# Altium schematic sheet Power_Circuit.SchDoc
size 297 x 209 mm; SheetNumber: 2; SheetTotal: 6
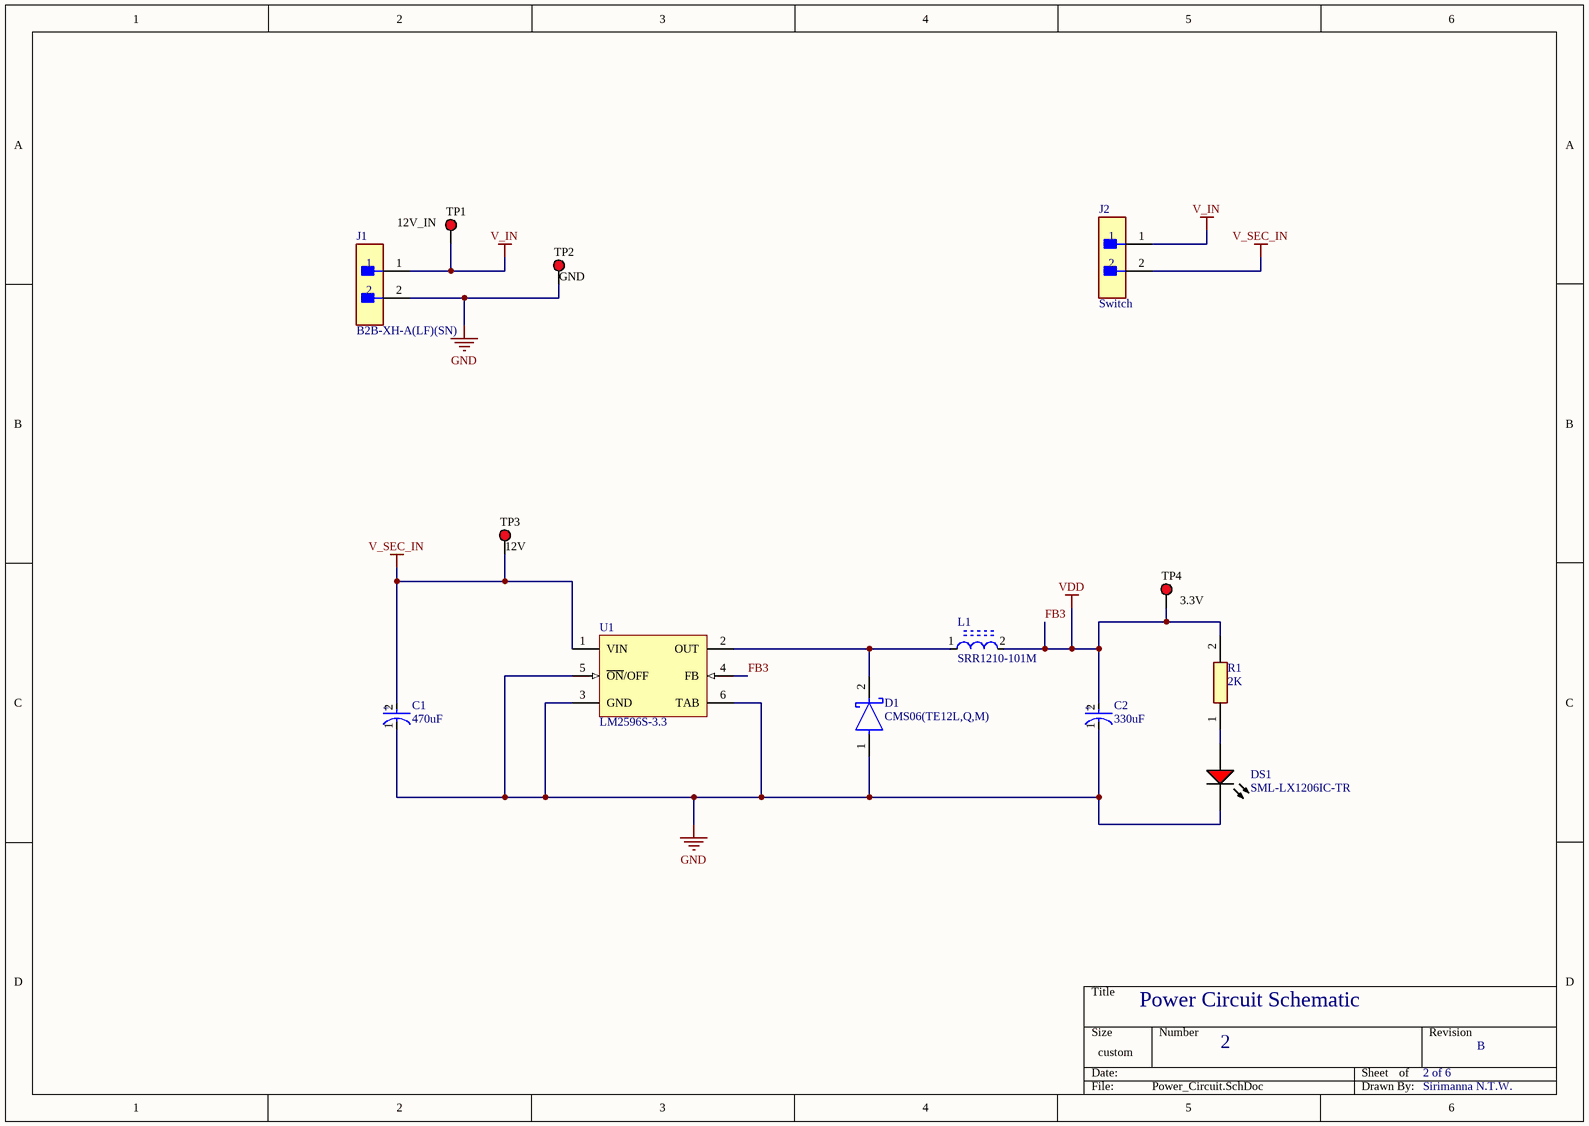
[diagram p0: Power_Circuit.SchDoc]

## Parts
C1  470uF  [FP-ZAG-MFG]
C2  330uF  [FP-FKG-MFG]
D1  CMS06(TE12L,Q,M)  [FP-M-FLAT-MFG]
DS1  SML-LX1206IC-TR  [LUMX-SML-LX1206IC_V]
J1  B2B-XH-A(LF)(SN)  [FP-B2B-XH-A_LF_SN-MFG]
J2  Switch  [FP-B2B-XH-A_LF_SN-MFG]
L1  SRR1210-101M  [FP-SRR1210-MFG]
R1  2K  [RESC3216X75N]
TP1  12V_IN  [KSTN-5010_V]
TP2  GND  [KSTN-5010_V]
TP3  12V  [KSTN-5010_V]
TP4  3.3V  [KSTN-5010_V]
U1  LM2596S-3.3  [KTT0005B_N]

## Nets
FB3: C2.2(A) L1.2 R1.2 TP4.1 U1.4(FB)  [also labelled VDD]
GND: C1.1(C) C2.1(C) D1.1(A) DS1.2(K) J1.2 TP2.1 U1.3(GND) U1.5(~{ON}/OFF) U1.6(TAB)
V_IN: J1.1 J2.1 TP1.1
V_SEC_IN: C1.2(A) J2.2 TP3.1 U1.1(VIN)
NetD1_2: D1.2(C) L1.1 U1.2(OUT)
NetDS1_1: DS1.1(A) R1.1

## Notes on the sheet
- Power Circuit Schematic
- 2
- 2 of 6
- B
- Sirimanna N.T.W.
- (in symbol CMP-2000-06221-2) +
- (in symbol CMP-05427-002115-1) +

## Library data of the parts
C1 = CMP-2000-06221-2: CAP ALUM POLY HYB 100UF 50V SMD; Manufacturer: Panasonic; Manufacturer Part Number: EEHZA1H101P; Material: Conductive Polymer; Tolerance: 20%; Dissipation Factor: 10%; Ripple Current: 2000mA; Life: 10000Hours; Esr: 28mΩ; Automotive Grade: Grade 2; Leakage Current: 50uA; Mouser Description: Cap Aluminum Polymer Hybrid 100uF 50VDC 20% (10 X 10.2mm) SMD 0.028 Ohm 2000mA 10000h 105C Embossed T/R; Automotive: Yes; Device Class L1: Passive Components; Voltage: 50V; Voltage Rating: 50V; ComponentLink2URL: https://industrial.panasonic.com/cdbs/www-data/pdf/RDD0000/ABA0000C1221.pdf; Mounting Type: Surface Mount; ComponentLink2Description: Datasheet; Temperature: -55°C to +105°C; RoHS: TRUE; Package: ZAG; Digikey Description: CAP ALUM POLY HYB 100UF 50V SMD; Temperature Range High: +105°C; Category: Cap; Height: 10.5mm; Value: 100uF; Device Class L2: Capacitors; Capacitance: 100uF; Lead Free: Yes; Temperature Range Low: -55°C; Footprint Url: https://industrial.panasonic.com/cdbs/www-data/pdf/RDD0000/DMD0000COL4.pdf; Device Class L3: Polymer Capacitors; Octopart: https://octopart.com/eeh-za1h101p-panasonic-22287466
C2 = CMP-05427-002115-1: CAP ALUM 330UF 20% 35V SMD; ESR (Equivalent Series Resistance): 80mR; Ripple Current: 850mA; Dielectric Material: Aluminium; Lead Length: 3.5mm; Life (Hours): 2000Hour; Leakage Current: 115.5uA; Length: 10.2mm; Construction: Cylindrical; Package Quantity: 500; Termination: SMD/SMT; RoHS Compliant: Yes; Impedance: 80mR; Width: 10.3mm; Height - Seated (Max): 0.402inch; Voltage: 35V; Voltage Rating: 35V; Diameter: 10mm; Contact Plating: Tin; Number of Pins: 2; Capacitance: 330uF; Case/Package: Radial; Reach SVHC Compliant: Yes; Lead Free: Lead Free; Series: FK; Ripple Current (AC): 850mA; Tolerance: 20%; Ratings: AEC-Q200; Lead Pitch: 4.6mm; Mount: Surface Mount; Height: 10.2mm; Max Operating Temperature: 105°C; Packaging: Tape and Reel; Min Operating Temperature: -55°C; Voltage Rating (DC): 35V; Radiation Hardening: No
D1 = CMP-2000-06115-2: DIODE SCHOTTKY 30V 2A MFLAT; Forward Voltage: 370mV; Peak Non-Repetitive Surge Current: 40A; Max Reverse Leakage Current: 3mA; Element Configuration: Single; Package Quantity: 1; Max Operating Temperature: 125°C; Mount: Surface Mount; Max Repetitive Reverse Voltage (Vrrm): 30V; Forward Current: 2A; Number of Pins: 2; Min Operating Temperature: -40°C; Radiation Hardening: No; Average Rectified Current: 2A; Contact Plating: Tin; Max Reverse Voltage (DC): 30V; Peak Reverse Current: 3mA; Max Surge Current: 40A; Packaging: Tape and Reel
DS1 = CMP-2000-07123-1: LED Red, 65 mW, -40 to 85 degC, 2-Pin SMD, RoHS, Tape and Reel; Manufacturer: Lumex; LED Material: GaAsP; Peak Wavelength: 635nm; Number of LEDs: 1; Viewing Angle: 160; Reverse Voltage: 5(Min)V; Lens Appearance: ColorlessNonDiffused; Intensity: 6mcd; Type: Uni-Color; Pin_Count: 2; Lens Dimensions: 2x1.6x0.5mm; Mounting: SurfaceMount; ECCN: EAR99; RoHS: Unknown; Package Description: 2-Pin Surface Mount Device, Body 3.2 x 1.5 mm; Mounting Technology: SurfaceMount; Dominant Wavelength: N/A; Supplier_Package: SMD; Supplier Standard Pack: 3,000; Color: Red; Dimension: 3.2x1.6x1.1mm; HTS: 8541402000; Part No: SML-LX1206IC-TR; Family: SML-LX1206IC; Supplier: Lumex; Datasheet URL: http://www.lumex.com/content/files/ProductAttachment/SML-LX1206IC-TR.pdf; Package Reference: SML-LX1206IC; Manufacturer URL: http://www.lumexinstruments.com/; Operating Temperature: -25to85C; Packaging: TapeandReel; Datasheet Version: Rev. J, 08/2012
J1 = CMP-2000-05888-3: CONN HEADER VERT 2POS 2.5MM; Current Rating: 3A; Voltage Rating: 250V; Number of Contacts: 2; Contact Resistance: 20mR; Wire/Cable Gauge: 22AWG; Insulation Resistance: 1GR; Connector Type: Male Pin; Packaging: Bulk; Contact Material: Brass; Lead Free: Lead Free; Orientation: Straight; Contact Plating: Tin; Max Current Rating: 3A; Termination: Solder; Fastening Type: Detent; Depth: 5.75mm; Housing Material: Polyamide; REACH SVHC: No SVHC; Series: XH; Voltage Rating (AC): 250V; Number of Positions: 2; Color: Natural; Contact Type: Male Pin; Max Voltage Rating (DC): 250V; Pitch: 2.5mm; Lead Pitch: 2.5mm; Mount: Through Hole; Max Operating Temperature: 85°C; Length: 7.4mm; Max Voltage Rating (AC): 250V; Min Operating Temperature: -25°C; Number of Rows: 1; Housing Color: White
J2 = CMP-2000-05888-3: To power Switch; Current Rating: 3A; Voltage Rating: 250V; Number of Contacts: 2; Contact Resistance: 20mR; Wire/Cable Gauge: 22AWG; Insulation Resistance: 1GR; Pitch: 2.5mm; Connector Type: Male Pin; Packaging: Bulk; Contact Material: Brass; Lead Free: Lead Free; Orientation: Straight; Contact Plating: Tin; Max Current Rating: 3A; Termination: Solder; Fastening Type: Detent; Depth: 5.75mm; Housing Material: Polyamide; REACH SVHC: No SVHC; Series: XH; Voltage Rating (AC): 250V; Number of Positions: 2; Color: Natural; Contact Type: Male Pin; Max Voltage Rating (DC): 250V; Lead Pitch: 2.5mm; Mount: Through Hole; Max Operating Temperature: 85°C; Length: 7.4mm; Max Voltage Rating (AC): 250V; Min Operating Temperature: -25°C; Number of Rows: 1; Housing Color: White
L1 = CMP-07248-000065-1: FIXED IND 100UH 2.5A 135MOHM SMD; Shielding: Shielded; DC Resistance (DCR): 135mR; Core Material: Ferrite; Inductance Tolerance: 20%; Saturation Current: 2.2A; Q Factor: 16; Self Resonant Frequency: 3MHz; Test Frequency: 100kHz; Height: 10mm; Width: 0.472inch; Mount: Surface Mount; Inductance: 100uH; RMS Current (Irms): 2.5A; Packaging: Tape and Reel; Max Operating Temperature: 125°C; Military Standard: Not; DC Current: 2.5A; Max DC Current: 2.5A; Length: 12mm; RoHS Compliant: Yes; Height - Seated (Max): 0.394inch; Resistor Type: Wirewound; Current Rating: 2.5A; REACH SVHC: No SVHC; Tolerance: 20%; Series: SRR1210; Package Quantity: 1; Min Operating Temperature: -40°C; Depth: 12.5mm; Case/Package: 1210; Termination: SMD/SMT
R1 = CR1206-FX-1022ELF: Resistor; Manufacturer_Name: Bourns; Datasheet Link: http://componentsearchengine.com/Datasheets/1/CR1206-FX-1022ELF.pdf; Height: 0.75mm; Manufacturer_Part_Number: CR1206-FX-1022ELF; Mouser Part Number: 652-CR1206FX-1022ELF; Mouser Price/Stock: https://www.mouser.co.uk/ProductDetail/Bourns/CR1206-FX-1022ELF?qs=3wWX5hyYeeRJQVfgTvfo2Q%3D%3D; Arrow Part Number: CR1206-FX-1022ELF; Arrow Price/Stock: https://www.arrow.com/en/products/cr1206-fx-1022elf/bourns
TP1-TP4 = CMP-1672-00002-4: Test Point, Red, Through Hole, RoHS, Bulk; Manufacturer: Keystone; Contact Material: Bronze; Mounting Technology: Through Hole; RoHSCompliant: true; Pins: 1; Package Quantity: 100; ComponentLink2Description: Datasheet; Height: 8.12 mm; ComponentLink1URL: http://www.keyelco.com/; DatasheetVersion: Rev. F, 12/2013; Mount: Through Hole; PackageReference: 5010; Contact Plating: Silver; Packaging: Bulk; Colour: Red; REACH SVHC: No SVHC; PackageDescription: 1-Pin Through Hole Device, Dia 3.17 mm; ComponentLink2URL: http://www.keyelco.com/product-pdf.cfm?p=1319; ComponentLink1Description: Manufacturer URL
U1 = CMP-0069-00276-3: SIMPLE SWITCHER® Power Converter 150 KHz 3A Step-Down Voltage Regulator, 5-pin TO-263; Manufacturer: Texas Instruments; PowerWise: N; PackageTopMarking: NSUZXYTTE#*LM2596S*-3.3 P+; ComponentLink1Description: Datasheet URL; RoHS: N; PackageDescription: TO-263, Molded, .400 x .390 x .180in, 5 Lead, .067in Pitch, Surface Mount; PackageReference: KTT0005B; Code_JEDEC: MO-169-AB; PinCount: 5; ComponentLink1URL: http://www.ti.com/general/docs/lit/getliterature.tsp?genericPartNumber=LM2596&fileType=pdf; CompType: Switcher